# Altium schematic sheet bridge.SchDoc
size A4
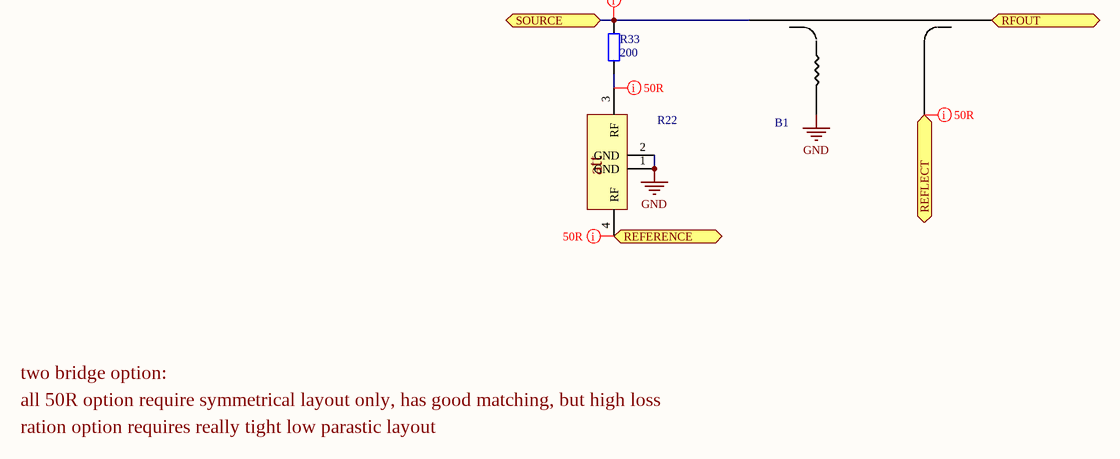
[diagram p0: bridge.SchDoc]

## Parts
B1  BRIDGE  [BRIDGE-4]  (value not drawn)
R22  EXB24-RF-ATT  [EXB24AT-RF-ATT]  (value not drawn)
R33  200  [0201]

## Ports
REFERENCE, REFLECT, RFOUT, SOURCE

## Nets
GND: B1.GND R22.1(GND) R22.2(GND)
REFERENCE: R22.4(RF) ; port REFERENCE
REFLECT: B1.COUPLE ; port REFLECT
RFOUT: B1.OUT ; port RFOUT
SOURCE: B1.SOURCE R33.2 ; port SOURCE
NetR22_3: R22.3(RF) R33.1

## Layout directives
net class 50R: NetR22_3, REFERENCE, REFLECT, SOURCE

## Notes on the sheet
- two bridge option:
- all 50R option require symmetrical layout only, has good matching, but high loss
- ration option requires really tight low parastic layout
- (in symbol EXB24-RF-ATT) att

## Library data of the parts
R33 = Res2: Resistor; Published: 8-Jun-2000; LatestRevisionDate: 17-Jul-2002; LatestRevisionNote: Re-released for DXP Platform.; PackageReference: AXIAL-0.4; Publisher: Altium Limited; PackageDescription: Axial Device, Thru-Hole; 2 Leads; 0.4 in Pin Spacing